# EAGLE design Netlight ESP12F Mk2 (EAGLE 7.6.0)
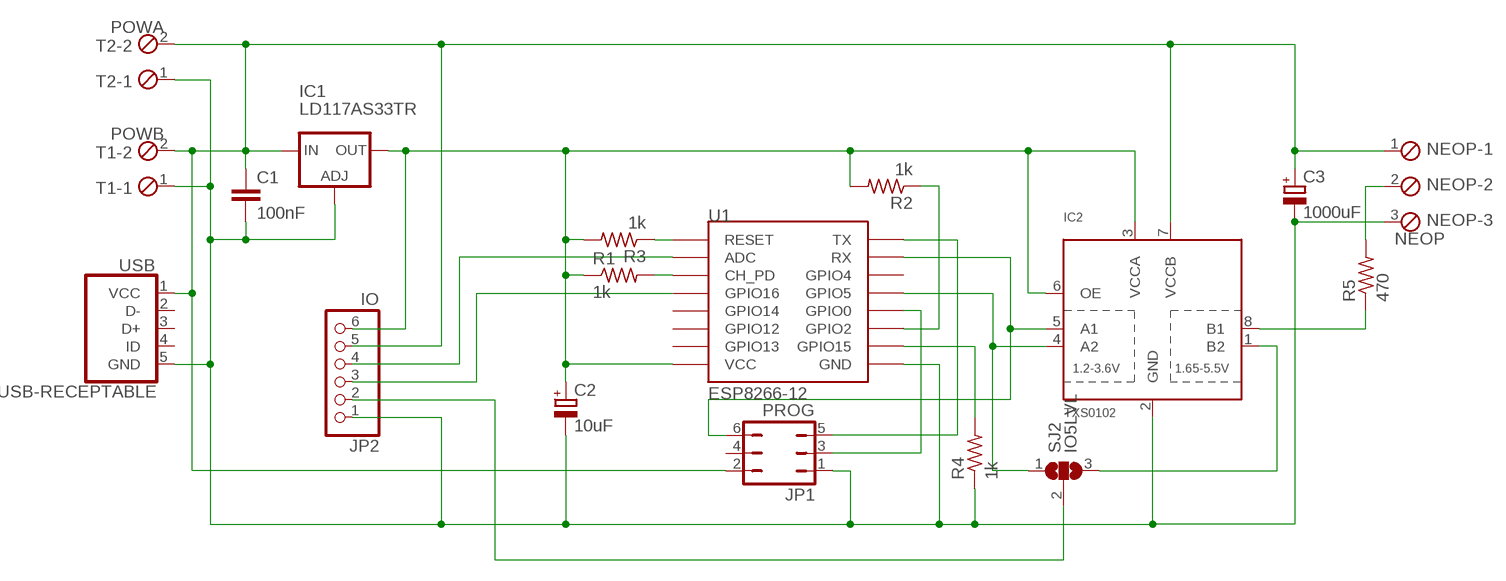
[diagram p0: schematic, sheet 1]

## Parts
C1  100nF  C-EUC1206  [C1206]
C2  10uF  CPOL-EUCT3528  [CT3528]
C3  1000uF  CPOL-EUG  [PANASONIC_G]
IC1  LD117AS33TR  [SOT223]
IC2  TXS0102  TXS0102SM8  [TI-SM8]
JP1  PROG  JP3Q  [JP3Q]
JP2  IO  PINHD-1X6  [1X06]
NEOP  NEOP  MPT3  [3POL254]
R1  1k  R-US_R0805  [R0805]
R2  1k  R-US_R0805  [R0805]
R3  1k  R-US_R0805  [R0805]
R4  1k  R-US_R0805  [R0805]
R5  470  R-US_R0805  [R0805]
SJ2  IO5LVL  SJ2W  [SJ_2]
T1  POWB  MPT2  [2POL254]
T2  POWA  MPT2  [2POL254]
U1  ESP8266-12  ESP12SMD  [ESP12-SMD]
USB  USB-RECEPTABLE  [FCI-10103594-0001LF]

## Nets
+3.3V: C2.+ IC1.4(OUT) IC2.3(VCCA) IC2.6(OE) JP2.6 R1.1 R2.2 R3.2 U1.VCC
+5V: C1.1 C3.+ IC1.3(IN) IC2.7(VCCB) JP1.2 JP2.5 NEOP.1 T1.2 T2.2 USB.1(VCC)
GND: C1.2 C2.- C3.- IC1.1(ADJ) IC2.2(GND) JP1.1 JP2.1 NEOP.3 R4.1 T1.1 T2.1 U1.GND USB.5(GND)
N$1: R2.1 U1.GPIO2
N$2: JP2.4 U1.ADC
N$3: JP2.3 U1.GPIO16
N$4: R1.2 U1.CH_PD
N$5: R3.1 U1.RESET
N$7: R4.2 U1.GPIO15
N$8: IC2.5(A1) JP1.6 U1.RXD0(RX)
N$9: IC2.8(B1) R5.1
N$10: NEOP.2 R5.2
N$11: IC2.4(A2) SJ2.1 U1.GPIO5
N$12: JP1.3 U1.GPIO0
N$13: JP1.5 U1.TXD0(TX)
N$14: JP2.2 SJ2.2
N$15: IC2.1(B2) SJ2.3
Unconnected: JP1.4 U1.GPIO4 U1.GPIO12 U1.GPIO13 U1.GPIO14 USB.2(D-) USB.3(D+) USB.4(ID)

## Library data of the parts
C1 = rcl:C-EU: CAPACITOR, European symbol
C2 C3 = rcl:CPOL-EU: POLARIZED CAPACITOR, European symbol
IC1 = v-reg:LD117A?*: Low drop fixed and adjustable positive voltage regulators 1 A Source: http://www.st.com/stonline/products/literature/ds/7194/ld1117axx.pdf
IC2 = My Custom Parts:TXS0102: 2-Bit Bi-Directional Level Shifter (I2C, etc.) Designed for I2C devices and has internal pullups. Not to be confused with TXB010x series. 1.2V-3.6V (VCCA) to 1.65V-5.5V (VCCB) bi-directional level shifter with auto direction sensing. Max data rate - 24Mbps (Push Pull), 2Mbps (Open Drain) Digikey: 296-21931-1-ND
JP1 = jumper:JP3Q: JUMPER
JP2 = pinhead:PINHD-1X6: PIN HEADER
NEOP = con-phoenix-254:MPT3: PHOENIX CONNECTOR; OC_FARNELL: unknown; OC_NEWARK: unknown
R1-R5 = rcl:R-US_: RESISTOR, American symbol
SJ2 = jumper:SJ2W: SMD solder JUMPER
T1 T2 = con-phoenix-254:MPT2: PHOENIX CONNECTOR; OC_FARNELL: unknown; OC_NEWARK: unknown
U1 = esp8266modules:ESP12: ESP8266 Wifi module 12
USB = daspilker:USB-RECEPTABLE: USB Receptable

## Net classes
0 default: width 0.254 mm
1 power: width 2.032 mm

## Board
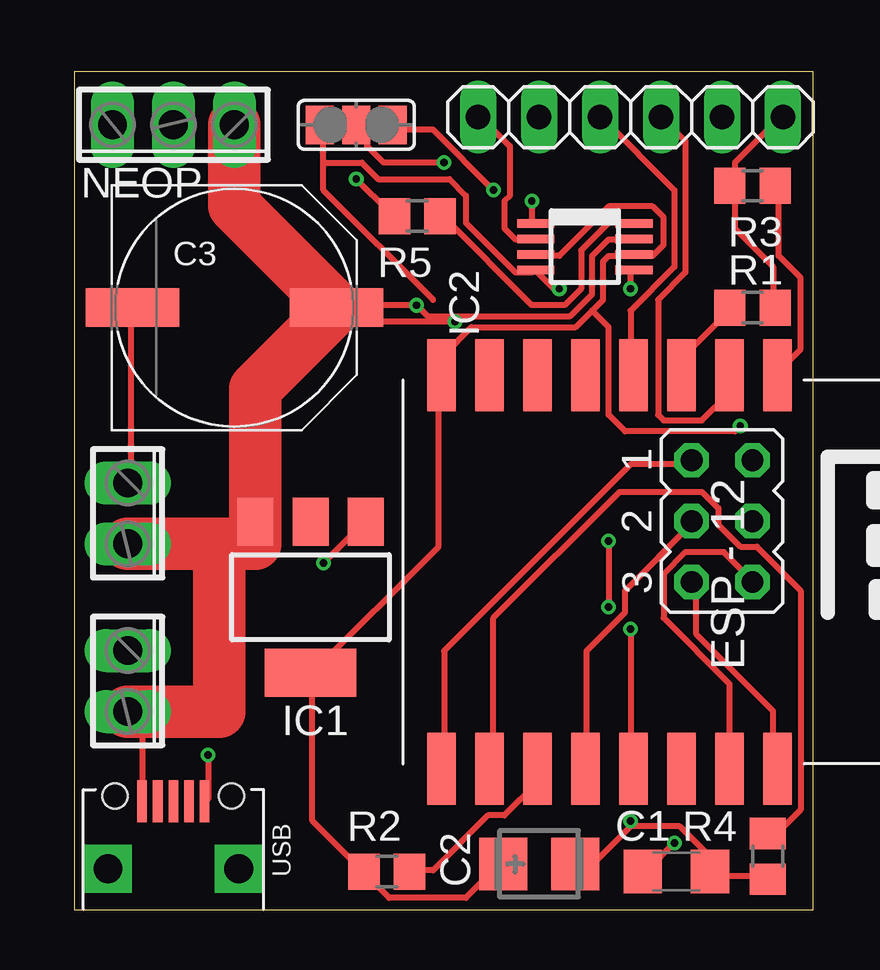
[diagram p1: board, top side]
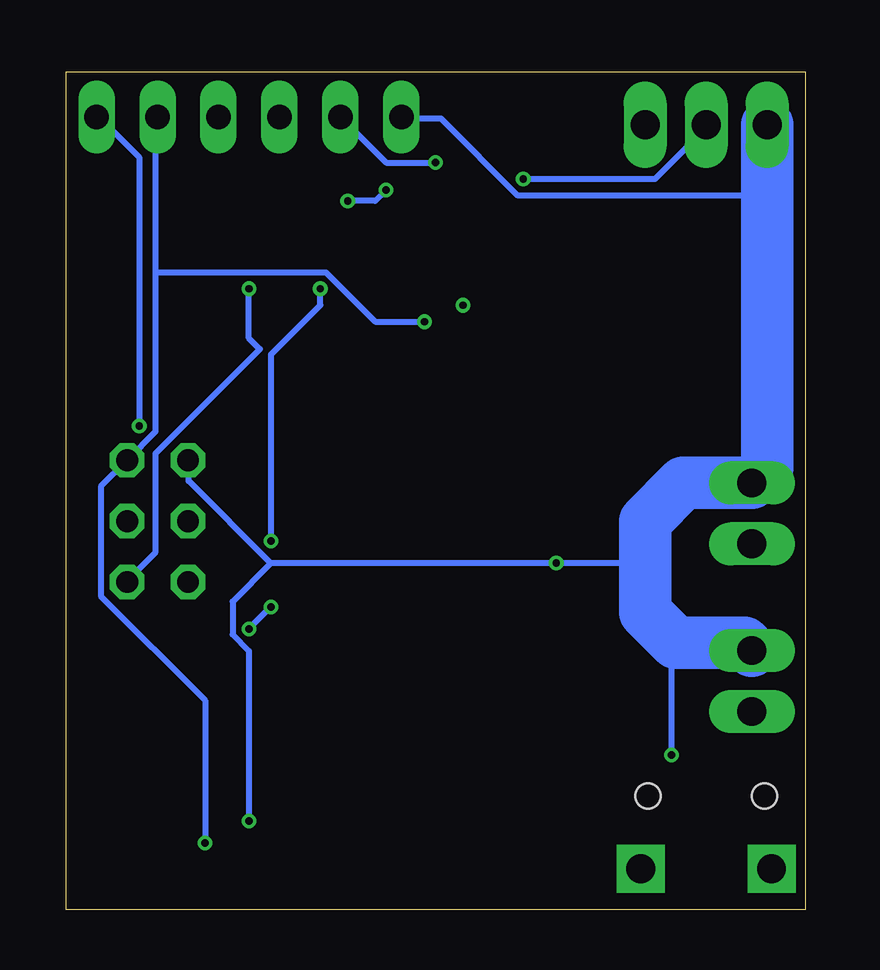
[diagram p2: board, bottom side, seen from below]

Size 30.79 x 34.91 mm. Coordinates in mm from the lower left corner, seen from the top.
Outline: 0,0 30.79,0 30.79,34.91 0,34.91 0,0
Copper layers (1*16): Top 0.035mm / dielectric 1.5mm / Bottom 0.035mm
Design rules "SeeedStudio_2layer_DRU_no_angle_20140221 *": minimum track width 10mil, minimum drill 12mil, track to track 8mil, track to pad 8mil, pad to pad 8mil, via to via 8mil, smd to smd 0mil, copper to edge 10mil, drill to drill 10mil, minimum pad ring 10mil, minimum via ring 6mil, stop-mask expansion 2mil, vias tented up to drill 100mil, thermal gap 10mil

### Footprints (pad centres in the part's own frame; a part is rotated, then mirrored left to right if it is on the bottom)
C1206 = smd 1.6 x 1.8: 1 -1.4,0; 2 1.4,0
CT3528 = smd 2 x 2.2: + -1.5,0; - 1.5,0
PANASONIC_G = smd 3.9 x 1.6: + 4.25,0; - -4.25,0
SOT223 = smd 1.5 x 2: 1 -2.3,-3.15; 2 0,-3.15; 3 2.3,-3.15 | smd 3.8 x 2: 4 0,3.15
TI-SM8 = smd 0.35 x 1.55: 1 -0.975,-2.05; 2 -0.325,-2.05; 3 0.325,-2.05; 4 0.975,-2.05; 5 0.975,2.05; 6 0.325,2.05; 7 -0.325,2.05; 8 -0.975,2.05
JP3Q = drill 0.914 octagon: 1 -2.54,-1.27; 2 -2.54,1.27; 3 0,-1.27; 4 0,1.27; 5 2.54,-1.27; 6 2.54,1.27
1X06 = drill 1.016 long: 1 -6.35,0; 2 -3.81,0; 3 -1.27,0; 4 1.27,0; 5 3.81,0; 6 6.35,0
3POL254 = drill 1.2 long: 1 -2.54,0; 2 0,0; 3 2.54,0
R0805 = smd 1.3 x 1.5: 1 -0.95,0; 2 0.95,0
SJ_2 = smd 1.168 x 1.6: 1 -1.524,0; 2 0,0; 3 1.524,0
2POL254 = drill 1.2 long: 1 -1.27,0; 2 1.27,0
ESP12-SMD = smd 3 x 1.2: ADC -8.3,3.8; CH_PD -8.3,1.8; GND 8.1,-8.2; GPIO0 8.1,-2.2; GPIO2 8.1,-4.2; GPIO4 8.1,1.8; GPIO5 8.1,-0.2; GPIO12 -8.3,-4.2; GPIO13 -8.3,-6.2; GPIO14 -8.3,-2.2; GPIO15 8.1,-6.2; GPIO16 -8.3,-0.2; RESET -8.3,5.8; RXD0 8.1,3.8; TXD0 8.1,5.8; VCC -8.3,-8.2
FCI-10103594-0001LF = smd 0.4 x 1.75: 1 -1.3,4.525; 2 -0.65,4.525; 3 0,4.525; 4 0.65,4.525; 5 1.3,4.525 | drill 1.2 pad 2 square: P$3 -2.725,1.7; P$4 2.725,1.7 | hole 1.05: -2.425,4.73; 2.425,4.73

### Placement (x,y rotation side)
C1  25.08,1.59 0 top
C2  19.37,1.91 0 top
C3  6.67,25.08 0 top
IC1  9.84,13.02 180 top
IC2  21.27,27.62 270 top
JP1  26.99,16.19 270 top
JP2  23.18,33.02 0 top
NEOP  4.13,32.7 180 top
R1  28.26,25.08 180 top
R2  13.02,1.59 180 top
R3  28.26,30.16 180 top
R4  28.89,2.22 90 top
R5  14.29,28.89 180 top
SJ2  11.75,32.7 0 top
T1  2.22,16.51 270 top
T2  2.22,9.53 270 top
U1  23.49,13.97 270 top
USB  4.13,0 0 top

### Tracks (layer width: path | path; a pad name or v marks a point on that pad's centre or on a via)
+3.3V  (via drill 0.3)
  Top 0.254: JP2.6 29.35,32.96 27.52,31.13 27.52,30.21 R3.2 27.52,29.98 27.52,28.38 29.12,26.78 29.12,25.18 R1.1 | C2.+ 17.69,1.87 16.32,0.5 13.12,0.5 12.2,1.41 R2.2 11.98,1.64 9.92,3.7 9.92,9.64 IC1.4 9.92,9.87 15.18,15.13 15.18,22.21 U1.VCC 15.41,22.44 15.41,23.13 16.55,24.27 20.89,24.27 21.58,24.96 | IC2.3 19.29,27.24 20.21,27.24 22.26,29.3 24.09,29.3 24.55,28.84 24.55,27.7 24.09,27.24 23.41,27.24 IC2.6 23.18,27.24 22.26,27.24 22.03,27.01 22.03,25.41 21.58,24.96 | 21.58,24.96 22.26,24.27 22.26,20.61 22.95,19.93 27.52,19.93 v27.75,20.15
  Bottom 0.254: v27.75,20.15 27.75,31.36 29.35,32.96 JP2.6
+5V  (via drill 0.3)
  Top 0.254: v25.01,2.78 23.86,1.64 C1.1 | 2.83,8.26 2.83,4.61 USB.1 | IC2.7 23.18,27.93 22.26,27.93 21.58,27.24 21.58,25.64 20.66,24.73 14.72,24.73 v14.26,25.18 11.98,25.18 C3.+ 11.75,24.5 v15.86,24.5
  Top 2.184: NEOP.1 6.67,29.33 C3.+ 7.54,21.71 IC1.3 7.54,15.24 6.03,15.24 | T1.2 6.03,15.24 | T2.2 2.83,8.26 6.03,8.26 6.03,15.24
  Bottom 0.254: v25.01,2.78 25.01,8.72 29.35,13.07 29.35,17.64 JP1.2 27.06,19.93 27.06,26.56 | 27.06,26.56 27.06,32.96 JP2.5 | v15.86,24.5 17.92,24.5 19.98,26.56 27.06,26.56
GND  (via drill 0.3)
  Top 0.254: R4.1 28.89,1.41 26.61,1.41 C1.2 26.38,1.64 26.38,2.32 25.23,3.47 23.18,3.47 | 23.18,3.47 21.81,2.1 20.89,2.1 C2.- | v5.58,6.44 5.58,4.61 USB.5 | v10.38,14.44 11.98,16.04 IC1.1 | U1.GND 15.41,5.98 15.41,10.78 23.18,18.55 25.69,18.55 JP1.1 | C3.- 2.37,24.96 2.37,17.87 T1.1 | v23.18,3.7 23.18,3.47 | IC2.2 19.06,27.93 18.38,27.93 17.92,28.38 17.92,29.53 18.15,29.76 18.15,31.81 17.01,32.96 JP2.1
  Bottom 0.254: v5.58,6.44 5.58,10.1 5.4,11.11 | 6.67,14.44 v10.38,14.44 22.26,14.44 | 22.26,14.44 25.69,17.87 25.69,18.55 JP1.1 | 1.59,29.76 11.98,29.76 15.18,32.96 16.78,32.96 JP2.1 | 22.26,14.44 23.86,12.84 23.86,11.47 23.18,10.78 v23.18,3.7
  Bottom 2.184: NEOP.3 1.59,29.76 1.59,18.41 T1.1 5.08,17.78 6.67,16.19 6.67,14.44 6.67,12.38 5.4,11.11 2.54,11.11 T2.1
N$1
  Top 0.254: R2.1 14.03,1.64 14.95,1.64 17.23,3.92 17.92,3.92 19.29,5.3 19.29,5.75 U1.GPIO2
N$2
  Top 0.254: U1.ADC 27.29,22.21 27.29,21.53 26.15,20.38 24.55,20.38 24.32,20.61 24.32,25.41 25.46,26.56 25.46,32.04 24.55,32.96 JP2.4
N$3
  Top 0.254: 23.18,23.58 23.18,22.44 U1.GPIO16 23.18,23.58 | 23.18,23.58 23.18,24.96 25.01,26.78 25.01,29.98 22.03,32.96 JP2.3
N$4
  Top 0.254: R1.2 27.29,24.96 25.46,23.13 25.46,22.44 U1.CH_PD
N$5
  Top 0.254: R3.1 29.35,29.98 29.35,27.24 30.26,26.33 30.26,23.36 29.35,22.44 U1.RESET
N$7
  Top 0.254: R4.2 28.89,3.24 29.35,3.24 30.26,4.15 30.26,13.3 28.44,15.13 27.75,15.13 26.84,16.04 26.84,16.73 26.15,17.41 22.72,17.41 17.46,12.15 17.46,5.98 U1.GPIO15
N$8  (via drill 0.3)
  Top 0.254: U1.RXD0 27.29,5.98 27.29,9.41 24.55,12.15 24.55,13.98 25.46,14.9 27.06,14.9 28.21,13.75 JP1.6 | v23.18,25.87 23.18,26.56 IC2.5
  Bottom 0.254: JP1.6 28.21,13.75 27.06,14.9 27.06,19.01 22.72,23.36 23.18,23.81 v23.18,25.87
N$9
  Top 0.254: R5.1 15.41,28.84 19.06,25.18 20.43,25.18 21.12,25.87 21.12,27.47 22.26,28.61 23.18,28.61 IC2.8
N$10  (via drill 0.3)
  Top 0.254: v11.75,30.44 13.12,29.07 R5.2
  Bottom 0.254: v11.75,30.44 6.26,30.44 4.2,32.5 NEOP.2
N$11  (via drill 0.3)
  Top 0.254: 10.38,31.13 10.38,29.98 14.95,25.41 | 10.38,31.13 10.38,32.5 SJ2.1 | 10.38,31.13 11.98,31.13 12.66,30.44 15.63,30.44 16.32,29.76 16.32,28.61 18.38,26.56 19.06,26.56 IC2.4 19.29,26.56 19.98,25.87 v20.21,25.87 | v23.18,11.7 23.18,5.98 U1.GPIO5 | v22.26,15.35 v22.26,12.61
  Bottom 0.254: v22.26,15.35 22.26,23.13 20.21,25.18 v20.21,25.87 | v22.26,12.61 v23.18,11.7
N$12
  Top 0.254: JP1.3 25.69,16.04 22.95,13.3 22.95,12.38 21.35,10.78 21.35,5.98 U1.GPIO0
N$13
  Top 0.254: JP1.5 25.92,13.53 25.92,11.47 29.12,8.27 29.12,5.98 U1.TXD0
N$14  (via drill 0.3)
  Top 0.254: v15.41,31.13 12.89,31.13 12.2,31.81 12.2,32.04 11.75,32.5 SJ2.2
  Bottom 0.254: v15.41,31.13 17.46,31.13 19.29,32.96 JP2.2
N$15  (via drill 0.3)
  Top 0.254: v17.46,29.98 14.95,32.5 13.35,32.5 SJ2.3 | v19.06,29.53 19.06,28.61 IC2.1
  Bottom 0.254: v19.06,29.53 17.92,29.53 v17.46,29.98

### Text on the board
tValues: - | +
bValues: GND | +5V | IO0 | NC | TX | RX | NetLight / v1.0 / http://linusdillon.com
_tsilk: 5 3.3 | * | - | + | - | +